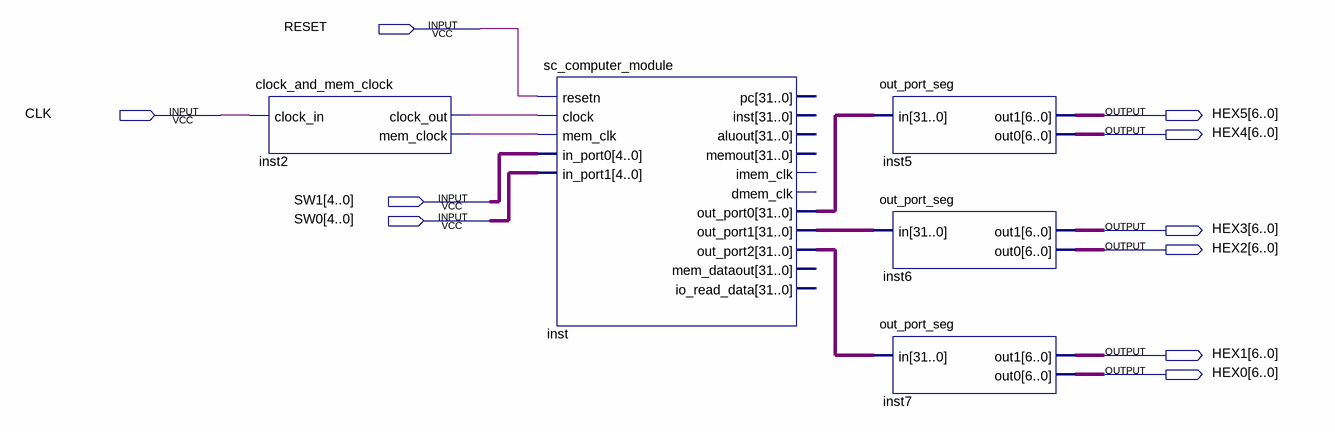
[diagram p0: schematic sheet]
// Quartus schematic sc_computer.bdf as structural Verilog: 5 symbols, 10 pins
module sc_computer (
  input  RESET,
  input  CLK,
  input  [4:0] SW1,
  input  [4:0] SW0,
  output [6:0] HEX5,
  output [6:0] HEX4,
  output [6:0] HEX3,
  output [6:0] HEX2,
  output [6:0] HEX1,
  output [6:0] HEX0
);

  wire inst2_clock_out, inst2_mem_clock;
  wire [31:0] inst_out_port0, inst_out_port1, inst_out_port2;

  clock_and_mem_clock inst2 (.clock_in(CLK), .clock_out(inst2_clock_out), .mem_clock(inst2_mem_clock));
  sc_computer_module inst (
    .resetn(RESET), .clock(inst2_clock_out), .mem_clk(inst2_mem_clock), .in_port0(SW1), .in_port1(SW0),
    .out_port0(inst_out_port0), .out_port1(inst_out_port1), .out_port2(inst_out_port2));  // open: pc, inst, aluout, memout, imem_clk, dmem_clk, mem_dataout, io_read_data
  out_port_seg inst5 (.in(inst_out_port0), .out1(HEX5), .out0(HEX4));
  out_port_seg inst6 (.in(inst_out_port1), .out1(HEX3), .out0(HEX2));
  out_port_seg inst7 (.in(inst_out_port2), .out1(HEX1), .out0(HEX0));
endmodule
